# EAGLE schematic main (EAGLE 9.6.2)
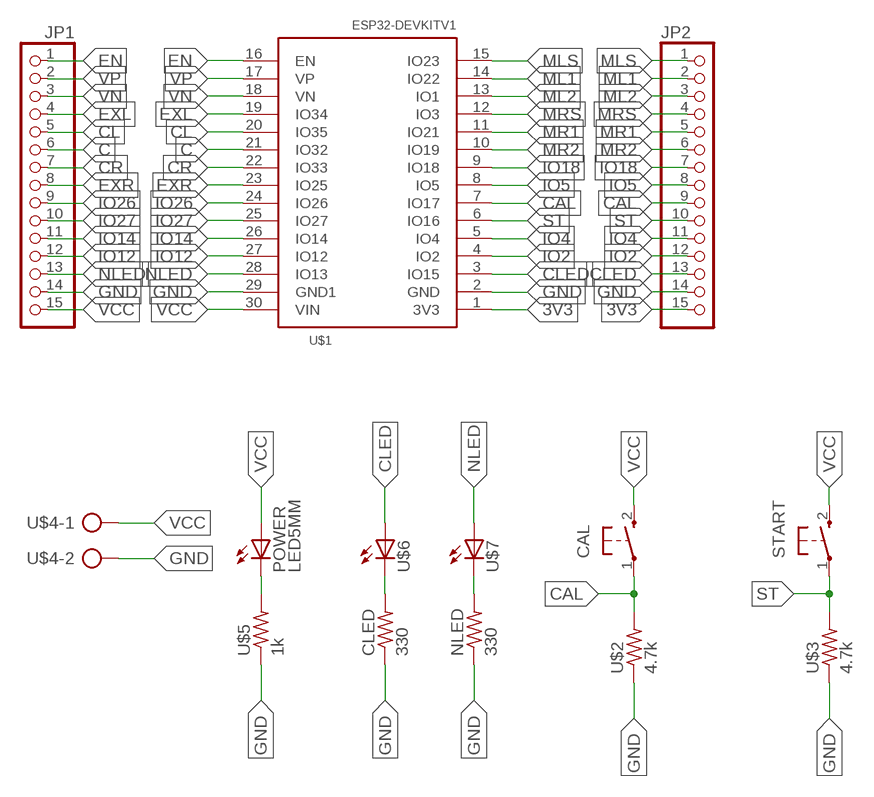
[diagram p0: schematic, sheet 1]

## Parts
CAL  PUSH_BUTTON  [B3F-10XX]
CLED  330  RES-7  [0204/7]
JP1  PINHD-1X15  [1X15]
JP2  PINHD-1X15  [1X15]
NLED  330  RES-7  [0204/7]
POWER  LED5MM  [LED5MM]
START  PUSH_BUTTON  [B3F-10XX]
U$1  ESP32DEVKITV1  [ESP32-DEVKITV1]
U$2  4.7k  RES-7  [0204/7]
U$3  4.7k  RES-7  [0204/7]
U$4  CON_PTR_2(V_2)  [AK300/2]
U$5  1k  RES-7  [0204/7]
U$6  LED5MM  [LED5MM]
U$7  LED5MM  [LED5MM]

## Nets
3V3: JP2.15 U$1.1(3V3)
C: JP1.6 U$1.21(IO32)
CAL: CAL.1(P) JP2.9 U$1.7(IO17) U$2.2
CL: JP1.5 U$1.20(IO35)
CLED: JP2.13 U$1.3(IO15) U$6.A
CR: JP1.7 U$1.22(IO33)
EN: JP1.1 U$1.16(EN)
EXL: JP1.4 U$1.19(IO34)
EXR: JP1.8 U$1.23(IO25)
GND: CLED.1 JP1.14 JP2.14 NLED.1 U$1.2(GND) U$1.29(GND1) U$2.1 U$3.1 U$4.2 U$5.1
IO2: JP2.12 U$1.4(IO2)
IO4: JP2.11 U$1.5(IO4)
IO5: JP2.8 U$1.8(IO5)
IO12: JP1.12 U$1.27(IO12)
IO14: JP1.11 U$1.26(IO14)
IO18: JP2.7 U$1.9(IO18)
IO26: JP1.9 U$1.24(IO26)
IO27: JP1.10 U$1.25(IO27)
ML1: JP2.2 U$1.14(IO22)
ML2: JP2.3 U$1.13(IO1)
MLS: JP2.1 U$1.15(IO23)
MR1: JP2.5 U$1.11(IO21)
MR2: JP2.6 U$1.10(IO19)
MRS: JP2.4 U$1.12(IO3)
N$2: POWER.K(C) U$5.2
N$4: CLED.2 U$6.K(C)
N$5: NLED.2 U$7.K(C)
NLED: JP1.13 U$1.28(IO13) U$7.A
ST: JP2.10 START.1(P) U$1.6(IO16) U$3.2
VCC: CAL.2(S) JP1.15 POWER.A START.2(S) U$1.30(VIN) U$4.1
VN: JP1.3 U$1.18(VN)
VP: JP1.2 U$1.17(VP)

## Library data of the parts
CAL START = MIA_LIBRARY-2-2-2:PUSH_BUTTON: OMRON SWITCH
CLED NLED U$2 U$3 U$5 = MIA_LIBRARY-2-2-2:RES-7
JP1 JP2 = MIA_LIBRARY-2-2-2:PINHD-1X15: PIN HEADER
POWER U$6 U$7 = MIA_LIBRARY-2-2-2:LED5MM
U$1 = MIA_LIBRARY-2-2-2:ESP32DEVKITV1
U$4 = MIA_LIBRARY-2-2-2:CON_PTR_2(V_2)